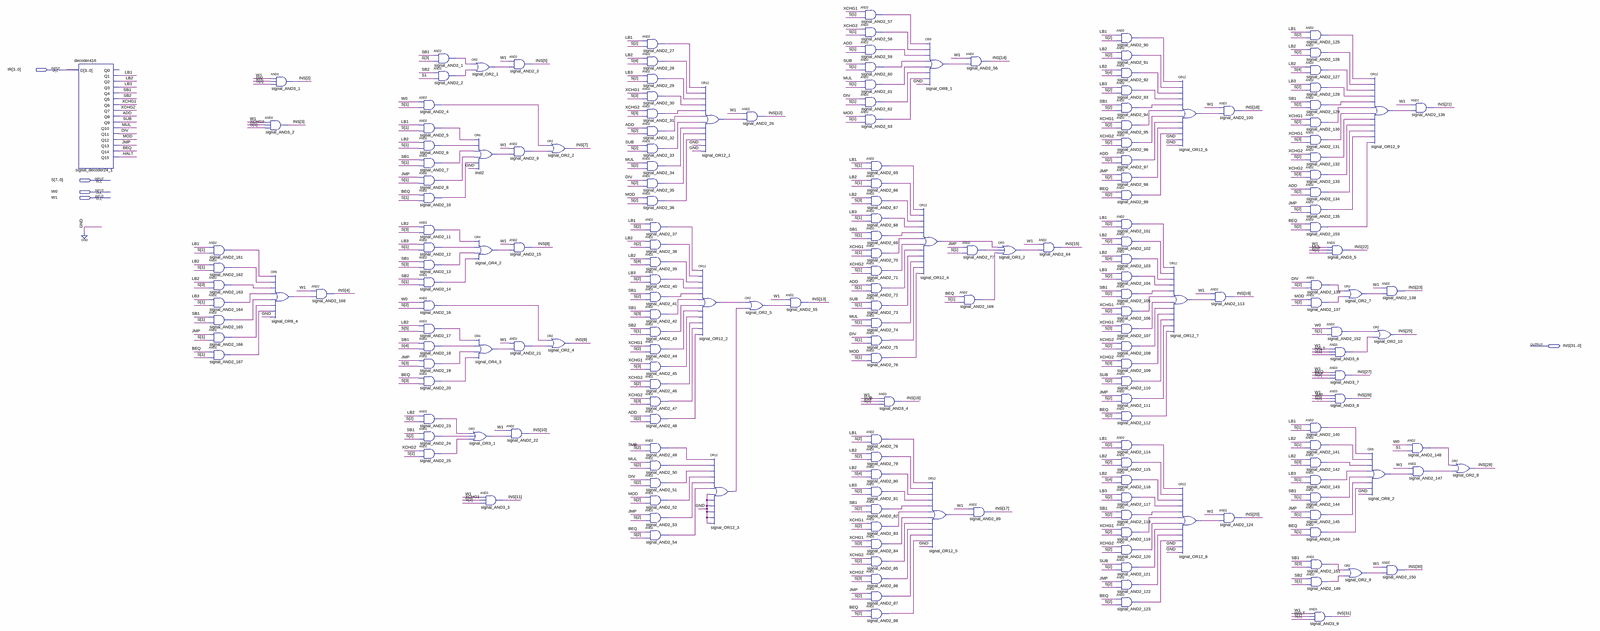
[diagram p0: schematic sheet, whole]
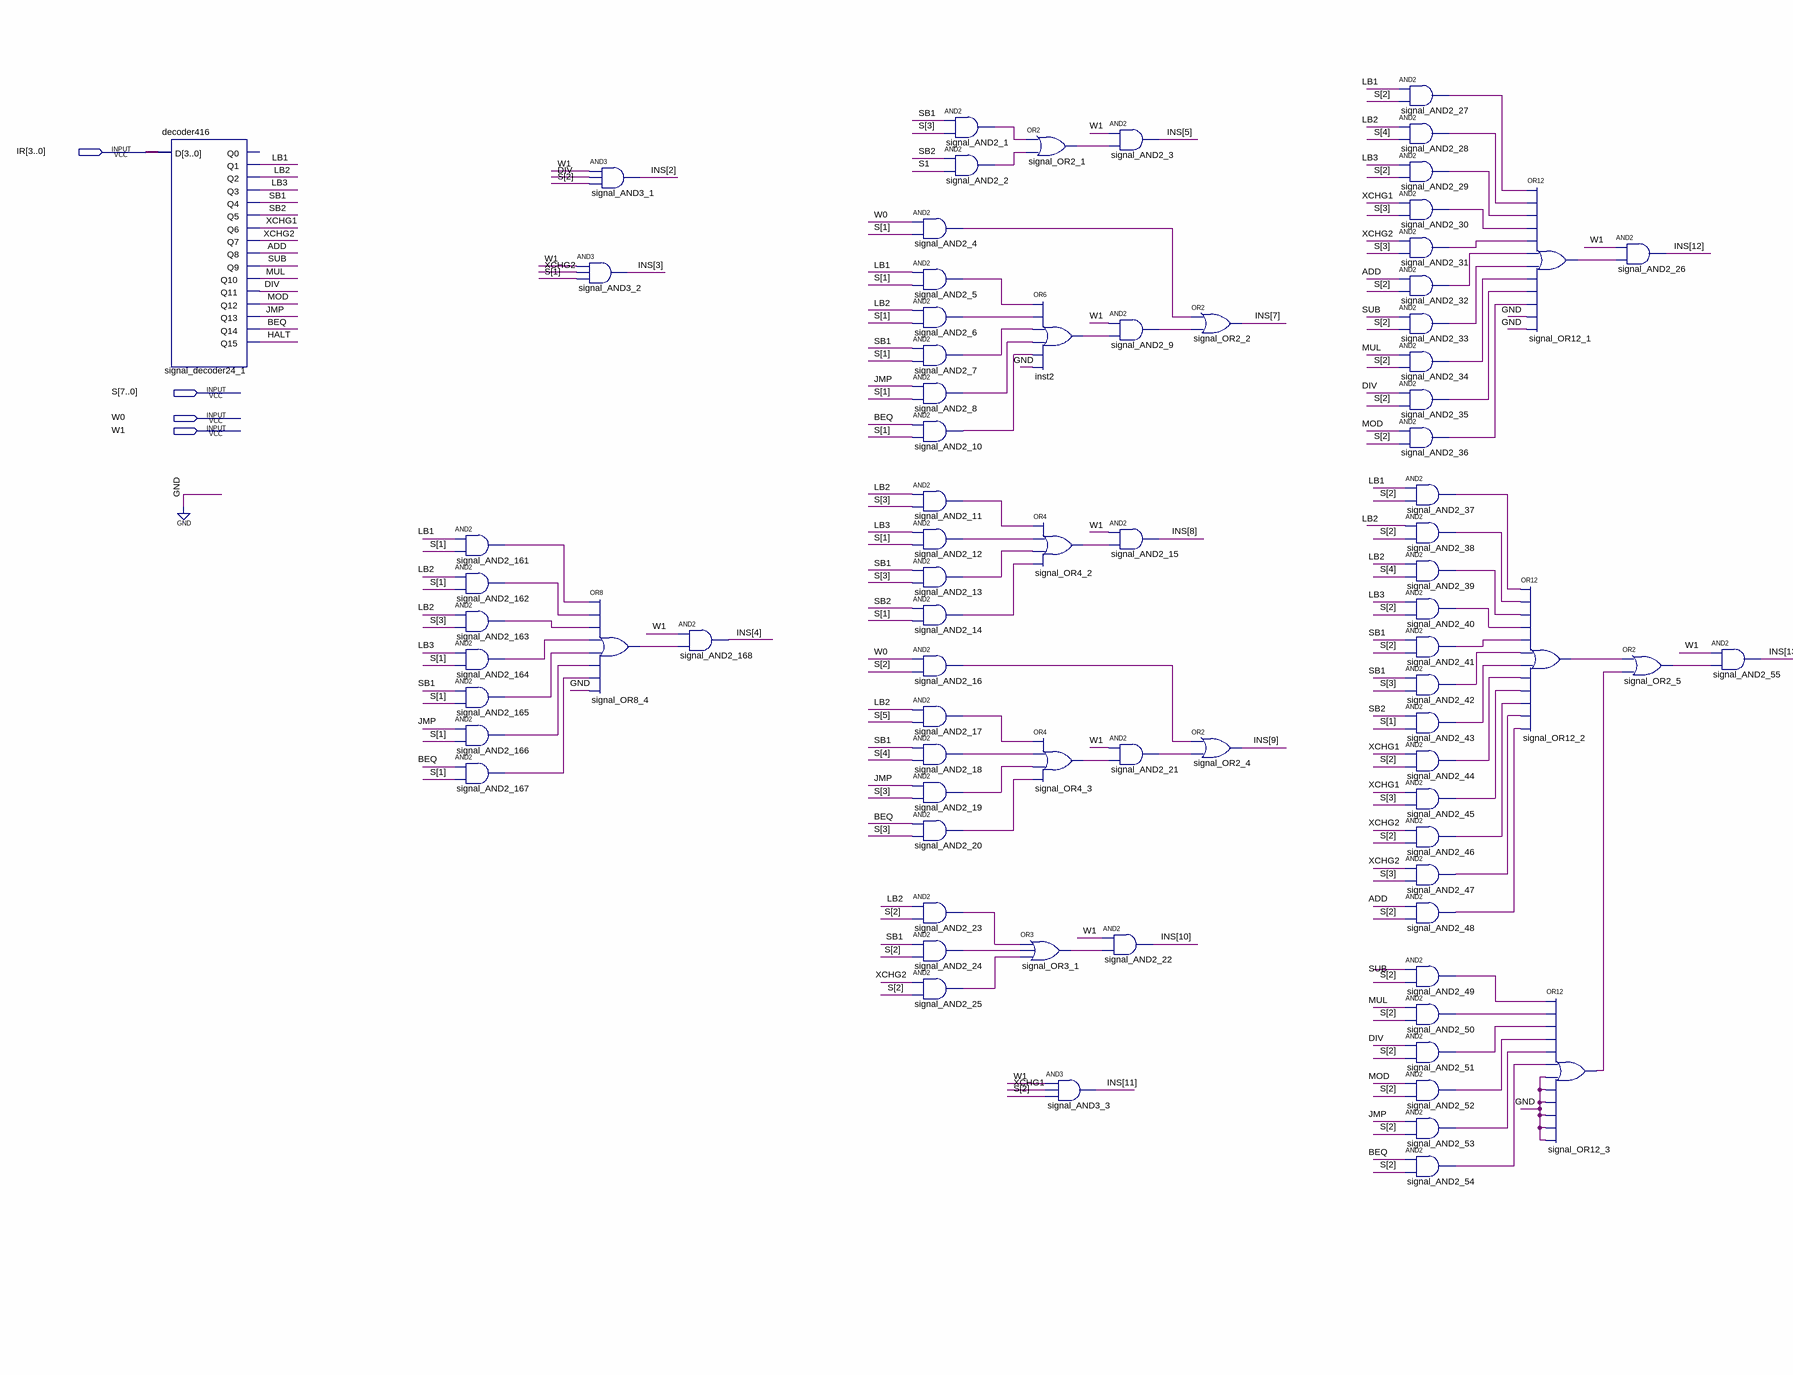
[diagram p1: schematic sheet, left part]
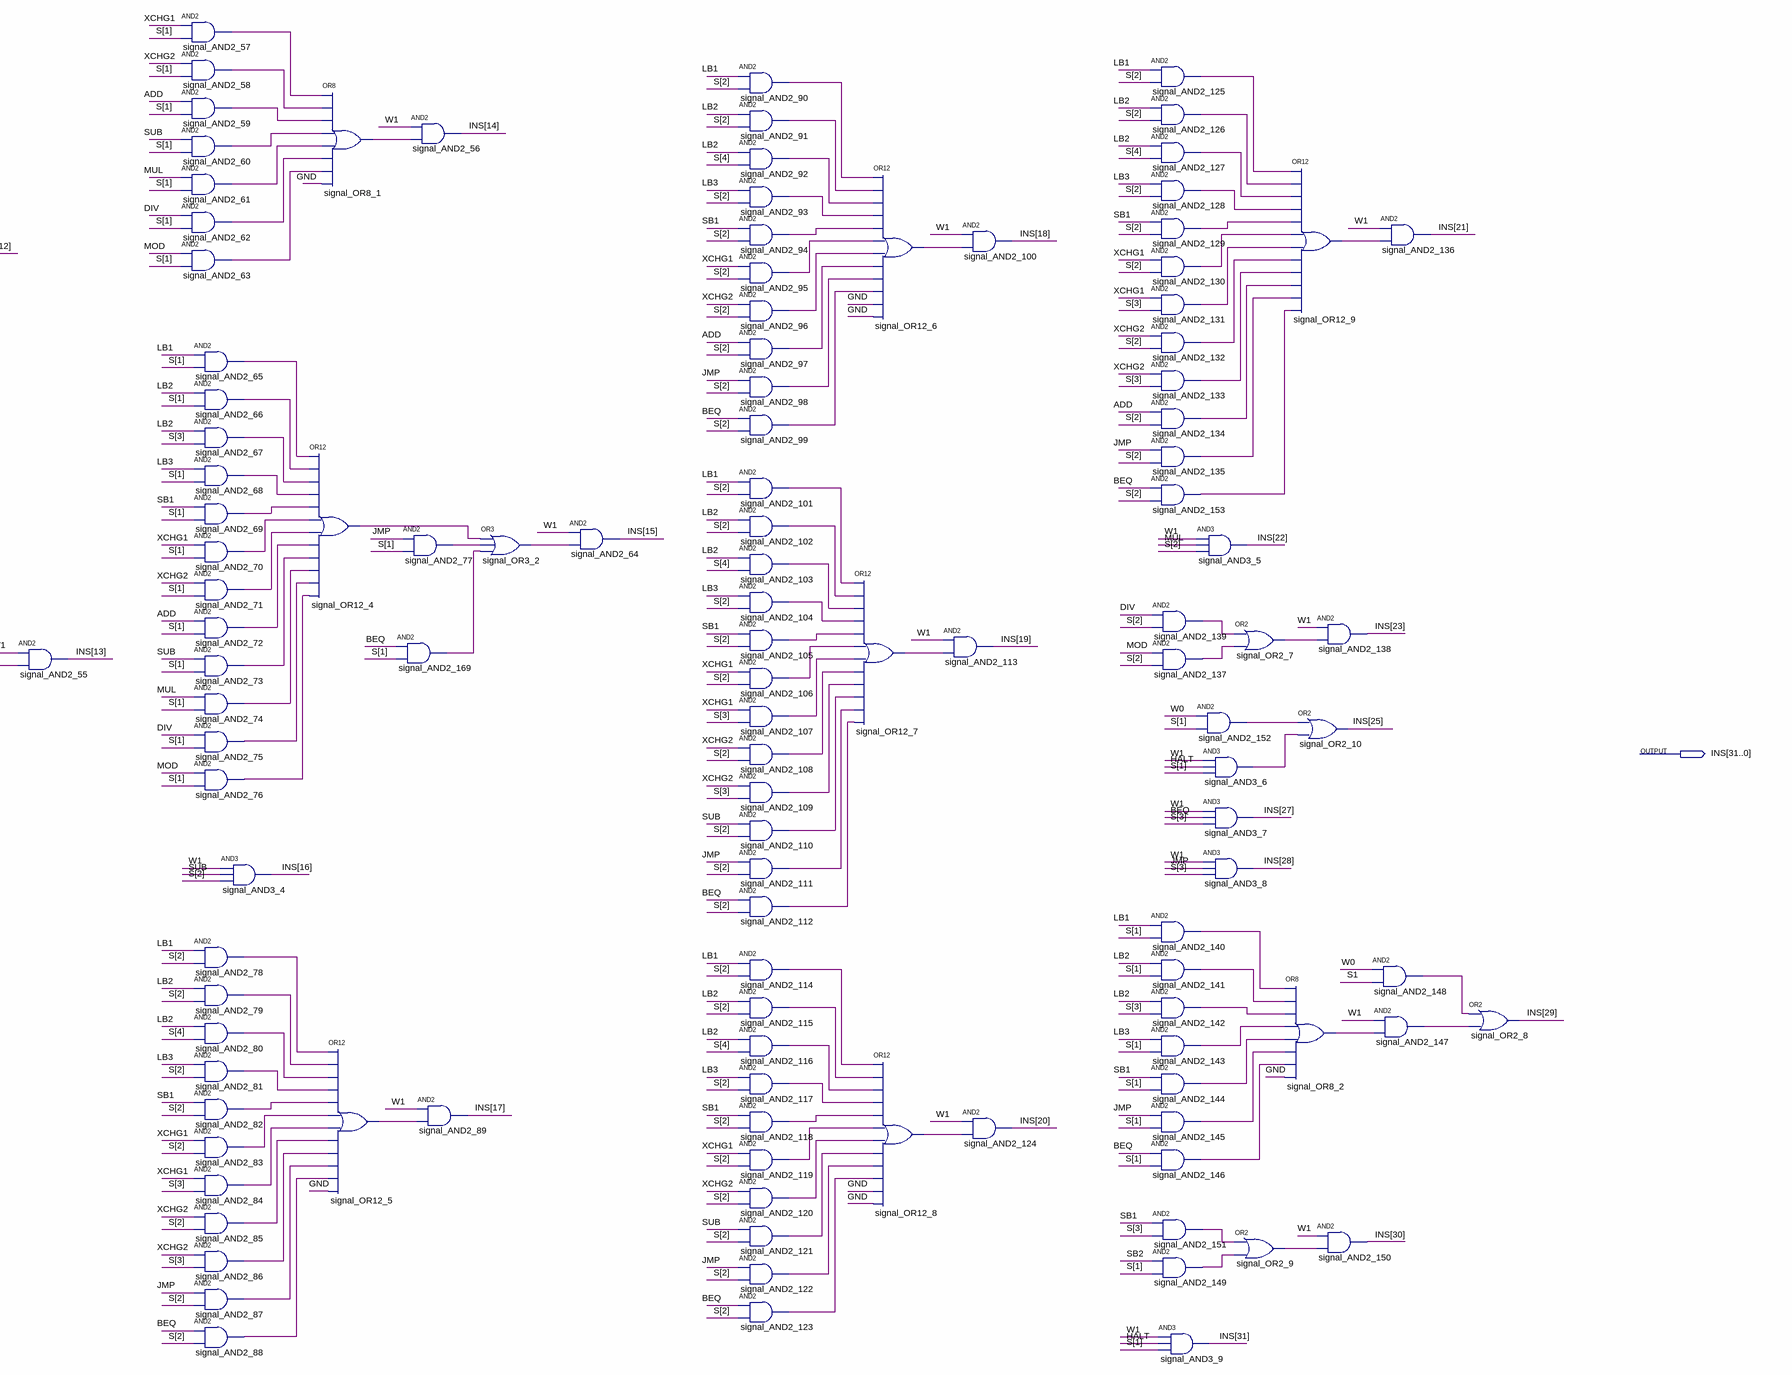
[diagram p2: schematic sheet, right part]
// Quartus schematic signal.bdf as structural Verilog: 197 symbols, 5 pins
module signal (
  input  [3:0] IR,
  input  [7:0] S,
  input  W0,
  input  W1,
  output [31:0] INS
);

  wire ADD, BEQ, DIV, HALT, inst2_out, JMP, LB1, LB2, LB3, MOD, MUL, SB1, SB2, signal_AND2_1_out,
       signal_AND2_2_out, signal_AND2_4_out, signal_AND2_5_out, signal_AND2_6_out, signal_AND2_7_out,
       signal_AND2_8_out, signal_AND2_9_out, signal_AND2_10_out, signal_AND2_11_out, signal_AND2_12_out,
       signal_AND2_13_out, signal_AND2_14_out, signal_AND2_16_out, signal_AND2_17_out, signal_AND2_18_out,
       signal_AND2_19_out, signal_AND2_20_out, signal_AND2_21_out, signal_AND2_23_out, signal_AND2_24_out,
       signal_AND2_25_out, signal_AND2_27_out, signal_AND2_28_out, signal_AND2_29_out, signal_AND2_30_out,
       signal_AND2_31_out, signal_AND2_32_out, signal_AND2_33_out, signal_AND2_34_out, signal_AND2_35_out,
       signal_AND2_36_out, signal_AND2_37_out, signal_AND2_38_out, signal_AND2_39_out, signal_AND2_40_out,
       signal_AND2_41_out, signal_AND2_42_out, signal_AND2_43_out, signal_AND2_44_out, signal_AND2_45_out,
       signal_AND2_46_out, signal_AND2_47_out, signal_AND2_48_out, signal_AND2_49_out, signal_AND2_50_out,
       signal_AND2_51_out, signal_AND2_52_out, signal_AND2_53_out, signal_AND2_54_out, signal_AND2_57_out,
       signal_AND2_58_out, signal_AND2_59_out, signal_AND2_60_out, signal_AND2_61_out, signal_AND2_62_out,
       signal_AND2_63_out, signal_AND2_65_out, signal_AND2_66_out, signal_AND2_67_out, signal_AND2_68_out,
       signal_AND2_69_out, signal_AND2_70_out, signal_AND2_71_out, signal_AND2_72_out, signal_AND2_73_out,
       signal_AND2_74_out, signal_AND2_75_out, signal_AND2_76_out, signal_AND2_77_out, signal_AND2_78_out,
       signal_AND2_79_out, signal_AND2_80_out, signal_AND2_81_out, signal_AND2_82_out, signal_AND2_83_out,
       signal_AND2_84_out, signal_AND2_85_out, signal_AND2_86_out, signal_AND2_87_out, signal_AND2_88_out,
       signal_AND2_90_out, signal_AND2_91_out, signal_AND2_92_out, signal_AND2_93_out, signal_AND2_94_out,
       signal_AND2_95_out, signal_AND2_96_out, signal_AND2_97_out, signal_AND2_98_out, signal_AND2_99_out,
       signal_AND2_101_out, signal_AND2_102_out, signal_AND2_103_out, signal_AND2_104_out,
       signal_AND2_105_out, signal_AND2_106_out, signal_AND2_107_out, signal_AND2_108_out,
       signal_AND2_109_out, signal_AND2_110_out, signal_AND2_111_out, signal_AND2_112_out,
       signal_AND2_114_out, signal_AND2_115_out, signal_AND2_116_out, signal_AND2_117_out,
       signal_AND2_118_out, signal_AND2_119_out, signal_AND2_120_out, signal_AND2_121_out,
       signal_AND2_122_out, signal_AND2_123_out, signal_AND2_125_out, signal_AND2_126_out,
       signal_AND2_127_out, signal_AND2_128_out, signal_AND2_129_out, signal_AND2_130_out,
       signal_AND2_131_out, signal_AND2_132_out, signal_AND2_133_out, signal_AND2_134_out,
       signal_AND2_135_out, signal_AND2_137_out, signal_AND2_139_out, signal_AND2_140_out,
       signal_AND2_141_out, signal_AND2_142_out, signal_AND2_143_out, signal_AND2_144_out,
       signal_AND2_145_out, signal_AND2_146_out, signal_AND2_147_out, signal_AND2_148_out,
       signal_AND2_149_out, signal_AND2_151_out, signal_AND2_152_out, signal_AND2_153_out,
       signal_AND2_161_out, signal_AND2_162_out, signal_AND2_163_out, signal_AND2_164_out,
       signal_AND2_165_out, signal_AND2_166_out, signal_AND2_167_out, signal_AND2_169_out, signal_AND3_6_out,
       signal_OR2_1_out, signal_OR2_5_out, signal_OR2_7_out, signal_OR2_9_out, signal_OR3_1_out,
       signal_OR3_2_out, signal_OR4_2_out, signal_OR4_3_out, signal_OR8_1_out, signal_OR8_2_out,
       signal_OR8_4_out, signal_OR12_1_out, signal_OR12_2_out, signal_OR12_3_out, signal_OR12_4_out,
       signal_OR12_5_out, signal_OR12_6_out, signal_OR12_7_out, signal_OR12_8_out, signal_OR12_9_out, SUB,
       XCHG1, XCHG2;

  decoder416 signal_decoder24_1 (
    .D(IR), .Q1(LB1), .Q2(LB2), .Q3(LB3), .Q4(SB1), .Q5(SB2), .Q6(XCHG1), .Q7(XCHG2), .Q8(ADD), .Q9(SUB),
    .Q10(MUL), .Q11(DIV), .Q12(MOD), .Q13(JMP), .Q14(BEQ), .Q15(HALT));  // open: Q0
  and signal_AND2_161 (signal_AND2_161_out, LB1, S[1]);
  and signal_AND2_162 (signal_AND2_162_out, LB2, S[1]);
  and signal_AND2_163 (signal_AND2_163_out, LB2, S[3]);
  and signal_AND2_164 (signal_AND2_164_out, LB3, S[1]);
  and signal_AND2_165 (signal_AND2_165_out, SB1, S[1]);
  and signal_AND2_166 (signal_AND2_166_out, JMP, S[1]);
  and signal_AND2_167 (signal_AND2_167_out, BEQ, S[1]);
  and signal_AND3_1 (INS[2], W1, DIV, S[2]);
  and signal_AND3_2 (INS[3], W1, XCHG2, S[1]);
  or signal_OR8_4 (signal_OR8_4_out, signal_AND2_161_out, signal_AND2_162_out, signal_AND2_163_out, signal_AND2_164_out, signal_AND2_165_out, signal_AND2_166_out, signal_AND2_167_out, 1'b0);
  and signal_AND2_168 (INS[4], W1, signal_OR8_4_out);
  and signal_AND2_1 (signal_AND2_1_out, SB1, S[3]);
  and signal_AND2_2 (signal_AND2_2_out, SB2, S[1]);
  and signal_AND2_4 (signal_AND2_4_out, W0, S[1]);
  and signal_AND2_5 (signal_AND2_5_out, LB1, S[1]);
  and signal_AND2_6 (signal_AND2_6_out, LB2, S[1]);
  and signal_AND2_7 (signal_AND2_7_out, SB1, S[1]);
  and signal_AND2_8 (signal_AND2_8_out, JMP, S[1]);
  and signal_AND2_10 (signal_AND2_10_out, BEQ, S[1]);
  and signal_AND2_11 (signal_AND2_11_out, LB2, S[3]);
  and signal_AND2_12 (signal_AND2_12_out, LB3, S[1]);
  and signal_AND2_13 (signal_AND2_13_out, SB1, S[3]);
  and signal_AND2_14 (signal_AND2_14_out, SB2, S[1]);
  and signal_AND2_16 (signal_AND2_16_out, W0, S[2]);
  and signal_AND2_17 (signal_AND2_17_out, LB2, S[5]);
  and signal_AND2_18 (signal_AND2_18_out, SB1, S[4]);
  and signal_AND2_19 (signal_AND2_19_out, JMP, S[3]);
  and signal_AND2_20 (signal_AND2_20_out, BEQ, S[3]);
  and signal_AND2_23 (signal_AND2_23_out, LB2, S[2]);
  and signal_AND2_24 (signal_AND2_24_out, SB1, S[2]);
  and signal_AND2_25 (signal_AND2_25_out, XCHG2, S[2]);
  or signal_OR2_1 (signal_OR2_1_out, signal_AND2_1_out, signal_AND2_2_out);
  or inst2 (inst2_out, signal_AND2_5_out, signal_AND2_6_out, signal_AND2_7_out, signal_AND2_8_out, signal_AND2_10_out, 1'b0);
  or signal_OR4_2 (signal_OR4_2_out, signal_AND2_11_out, signal_AND2_12_out, signal_AND2_13_out, signal_AND2_14_out);
  or signal_OR4_3 (signal_OR4_3_out, signal_AND2_17_out, signal_AND2_18_out, signal_AND2_19_out, signal_AND2_20_out);
  or signal_OR3_1 (signal_OR3_1_out, signal_AND2_23_out, signal_AND2_24_out, signal_AND2_25_out);
  and signal_AND3_3 (INS[11], W1, XCHG1, S[2]);
  and signal_AND2_3 (INS[5], W1, signal_OR2_1_out);
  and signal_AND2_9 (signal_AND2_9_out, W1, inst2_out);
  and signal_AND2_15 (INS[8], W1, signal_OR4_2_out);
  and signal_AND2_21 (signal_AND2_21_out, W1, signal_OR4_3_out);
  and signal_AND2_22 (INS[10], W1, signal_OR3_1_out);
  or signal_OR2_2 (INS[7], signal_AND2_4_out, signal_AND2_9_out);
  or signal_OR2_4 (INS[9], signal_AND2_16_out, signal_AND2_21_out);
  and signal_AND2_27 (signal_AND2_27_out, LB1, S[2]);
  and signal_AND2_28 (signal_AND2_28_out, LB2, S[4]);
  and signal_AND2_29 (signal_AND2_29_out, LB3, S[2]);
  and signal_AND2_30 (signal_AND2_30_out, XCHG1, S[3]);
  and signal_AND2_31 (signal_AND2_31_out, XCHG2, S[3]);
  and signal_AND2_32 (signal_AND2_32_out, ADD, S[2]);
  and signal_AND2_33 (signal_AND2_33_out, SUB, S[2]);
  and signal_AND2_34 (signal_AND2_34_out, MUL, S[2]);
  and signal_AND2_35 (signal_AND2_35_out, DIV, S[2]);
  and signal_AND2_36 (signal_AND2_36_out, MOD, S[2]);
  and signal_AND2_37 (signal_AND2_37_out, LB1, S[2]);
  and signal_AND2_38 (signal_AND2_38_out, LB2, S[2]);
  and signal_AND2_39 (signal_AND2_39_out, LB2, S[4]);
  and signal_AND2_40 (signal_AND2_40_out, LB3, S[2]);
  and signal_AND2_41 (signal_AND2_41_out, SB1, S[2]);
  and signal_AND2_42 (signal_AND2_42_out, SB1, S[3]);
  and signal_AND2_43 (signal_AND2_43_out, SB2, S[1]);
  and signal_AND2_44 (signal_AND2_44_out, XCHG1, S[2]);
  and signal_AND2_45 (signal_AND2_45_out, XCHG1, S[3]);
  and signal_AND2_46 (signal_AND2_46_out, XCHG2, S[2]);
  and signal_AND2_47 (signal_AND2_47_out, XCHG2, S[3]);
  and signal_AND2_48 (signal_AND2_48_out, ADD, S[2]);
  and signal_AND2_49 (signal_AND2_49_out, SUB, S[2]);
  and signal_AND2_50 (signal_AND2_50_out, MUL, S[2]);
  and signal_AND2_51 (signal_AND2_51_out, DIV, S[2]);
  and signal_AND2_52 (signal_AND2_52_out, MOD, S[2]);
  and signal_AND2_53 (signal_AND2_53_out, JMP, S[2]);
  and signal_AND2_54 (signal_AND2_54_out, BEQ, S[2]);
  or signal_OR12_1 (signal_OR12_1_out, signal_AND2_27_out, signal_AND2_28_out, signal_AND2_29_out, signal_AND2_30_out, signal_AND2_31_out, signal_AND2_32_out, signal_AND2_33_out, signal_AND2_34_out, signal_AND2_35_out, signal_AND2_36_out, 1'b0, 1'b0);
  or signal_OR12_2 (signal_OR12_2_out, signal_AND2_37_out, signal_AND2_38_out, signal_AND2_39_out, signal_AND2_40_out, signal_AND2_41_out, signal_AND2_42_out, signal_AND2_43_out, signal_AND2_44_out, signal_AND2_45_out, signal_AND2_46_out, signal_AND2_47_out, signal_AND2_48_out);
  or signal_OR12_3 (signal_OR12_3_out, signal_AND2_49_out, signal_AND2_50_out, signal_AND2_51_out, signal_AND2_52_out, signal_AND2_53_out, signal_AND2_54_out, 1'b0, 1'b0, 1'b0, 1'b0, 1'b0, 1'b0);
  and signal_AND2_26 (INS[12], W1, signal_OR12_1_out);
  or signal_OR2_5 (signal_OR2_5_out, signal_OR12_2_out, signal_OR12_3_out);
  and signal_AND2_55 (INS[13], W1, signal_OR2_5_out);
  and signal_AND2_57 (signal_AND2_57_out, XCHG1, S[1]);
  and signal_AND2_58 (signal_AND2_58_out, XCHG2, S[1]);
  and signal_AND2_59 (signal_AND2_59_out, ADD, S[1]);
  and signal_AND2_60 (signal_AND2_60_out, SUB, S[1]);
  and signal_AND2_61 (signal_AND2_61_out, MUL, S[1]);
  and signal_AND2_62 (signal_AND2_62_out, DIV, S[1]);
  and signal_AND2_63 (signal_AND2_63_out, MOD, S[1]);
  and signal_AND2_65 (signal_AND2_65_out, LB1, S[1]);
  and signal_AND2_66 (signal_AND2_66_out, LB2, S[1]);
  and signal_AND2_67 (signal_AND2_67_out, LB2, S[3]);
  and signal_AND2_68 (signal_AND2_68_out, LB3, S[1]);
  and signal_AND2_69 (signal_AND2_69_out, SB1, S[1]);
  and signal_AND2_70 (signal_AND2_70_out, XCHG1, S[1]);
  and signal_AND2_71 (signal_AND2_71_out, XCHG2, S[1]);
  and signal_AND2_72 (signal_AND2_72_out, ADD, S[1]);
  and signal_AND2_73 (signal_AND2_73_out, SUB, S[1]);
  and signal_AND2_74 (signal_AND2_74_out, MUL, S[1]);
  and signal_AND2_75 (signal_AND2_75_out, DIV, S[1]);
  and signal_AND2_76 (signal_AND2_76_out, MOD, S[1]);
  and signal_AND3_4 (INS[16], W1, SUB, S[2]);
  and signal_AND2_78 (signal_AND2_78_out, LB1, S[2]);
  and signal_AND2_79 (signal_AND2_79_out, LB2, S[2]);
  and signal_AND2_80 (signal_AND2_80_out, LB2, S[4]);
  and signal_AND2_81 (signal_AND2_81_out, LB3, S[2]);
  and signal_AND2_82 (signal_AND2_82_out, SB1, S[2]);
  and signal_AND2_83 (signal_AND2_83_out, XCHG1, S[2]);
  and signal_AND2_84 (signal_AND2_84_out, XCHG1, S[3]);
  and signal_AND2_85 (signal_AND2_85_out, XCHG2, S[2]);
  and signal_AND2_86 (signal_AND2_86_out, XCHG2, S[3]);
  and signal_AND2_87 (signal_AND2_87_out, JMP, S[2]);
  and signal_AND2_88 (signal_AND2_88_out, BEQ, S[2]);
  or signal_OR8_1 (signal_OR8_1_out, signal_AND2_57_out, signal_AND2_58_out, signal_AND2_59_out, signal_AND2_60_out, signal_AND2_61_out, signal_AND2_62_out, signal_AND2_63_out, 1'b0);
  or signal_OR12_4 (signal_OR12_4_out, signal_AND2_65_out, signal_AND2_66_out, signal_AND2_67_out, signal_AND2_68_out, signal_AND2_69_out, signal_AND2_70_out, signal_AND2_71_out, signal_AND2_72_out, signal_AND2_73_out, signal_AND2_74_out, signal_AND2_75_out, signal_AND2_76_out);
  or signal_OR12_5 (signal_OR12_5_out, signal_AND2_78_out, signal_AND2_79_out, signal_AND2_80_out, signal_AND2_81_out, signal_AND2_82_out, signal_AND2_83_out, signal_AND2_84_out, signal_AND2_85_out, signal_AND2_86_out, signal_AND2_87_out, signal_AND2_88_out, 1'b0);
  and signal_AND2_56 (INS[14], W1, signal_OR8_1_out);
  and signal_AND2_77 (signal_AND2_77_out, JMP, S[1]);
  and signal_AND2_169 (signal_AND2_169_out, BEQ, S[1]);
  and signal_AND2_89 (INS[17], W1, signal_OR12_5_out);
  or signal_OR3_2 (signal_OR3_2_out, signal_OR12_4_out, signal_AND2_77_out, signal_AND2_169_out);
  and signal_AND2_64 (INS[15], W1, signal_OR3_2_out);
  and signal_AND2_90 (signal_AND2_90_out, LB1, S[2]);
  and signal_AND2_91 (signal_AND2_91_out, LB2, S[2]);
  and signal_AND2_92 (signal_AND2_92_out, LB2, S[4]);
  and signal_AND2_93 (signal_AND2_93_out, LB3, S[2]);
  and signal_AND2_94 (signal_AND2_94_out, SB1, S[2]);
  and signal_AND2_95 (signal_AND2_95_out, XCHG1, S[2]);
  and signal_AND2_96 (signal_AND2_96_out, XCHG2, S[2]);
  and signal_AND2_97 (signal_AND2_97_out, ADD, S[2]);
  and signal_AND2_98 (signal_AND2_98_out, JMP, S[2]);
  and signal_AND2_99 (signal_AND2_99_out, BEQ, S[2]);
  and signal_AND2_101 (signal_AND2_101_out, LB1, S[2]);
  and signal_AND2_102 (signal_AND2_102_out, LB2, S[2]);
  and signal_AND2_103 (signal_AND2_103_out, LB2, S[4]);
  and signal_AND2_104 (signal_AND2_104_out, LB3, S[2]);
  and signal_AND2_105 (signal_AND2_105_out, SB1, S[2]);
  and signal_AND2_106 (signal_AND2_106_out, XCHG1, S[2]);
  and signal_AND2_107 (signal_AND2_107_out, XCHG1, S[3]);
  and signal_AND2_108 (signal_AND2_108_out, XCHG2, S[2]);
  and signal_AND2_109 (signal_AND2_109_out, XCHG2, S[3]);
  and signal_AND2_110 (signal_AND2_110_out, SUB, S[2]);
  and signal_AND2_111 (signal_AND2_111_out, JMP, S[2]);
  and signal_AND2_112 (signal_AND2_112_out, BEQ, S[2]);
  and signal_AND2_114 (signal_AND2_114_out, LB1, S[2]);
  and signal_AND2_115 (signal_AND2_115_out, LB2, S[2]);
  and signal_AND2_116 (signal_AND2_116_out, LB2, S[4]);
  and signal_AND2_117 (signal_AND2_117_out, LB3, S[2]);
  and signal_AND2_118 (signal_AND2_118_out, SB1, S[2]);
  and signal_AND2_119 (signal_AND2_119_out, XCHG1, S[2]);
  and signal_AND2_120 (signal_AND2_120_out, XCHG2, S[2]);
  and signal_AND2_121 (signal_AND2_121_out, SUB, S[2]);
  and signal_AND2_122 (signal_AND2_122_out, JMP, S[2]);
  and signal_AND2_123 (signal_AND2_123_out, BEQ, S[2]);
  or signal_OR12_6 (signal_OR12_6_out, signal_AND2_90_out, signal_AND2_91_out, signal_AND2_92_out, signal_AND2_93_out, signal_AND2_94_out, signal_AND2_95_out, signal_AND2_96_out, signal_AND2_97_out, signal_AND2_98_out, signal_AND2_99_out, 1'b0, 1'b0);
  or signal_OR12_7 (signal_OR12_7_out, signal_AND2_101_out, signal_AND2_102_out, signal_AND2_103_out, signal_AND2_104_out, signal_AND2_105_out, signal_AND2_106_out, signal_AND2_107_out, signal_AND2_108_out, signal_AND2_109_out, signal_AND2_110_out, signal_AND2_111_out, signal_AND2_112_out);
  or signal_OR12_8 (signal_OR12_8_out, signal_AND2_114_out, signal_AND2_115_out, signal_AND2_116_out, signal_AND2_117_out, signal_AND2_118_out, signal_AND2_119_out, signal_AND2_120_out, signal_AND2_121_out, signal_AND2_122_out, signal_AND2_123_out, 1'b0, 1'b0);
  and signal_AND2_100 (INS[18], W1, signal_OR12_6_out);
  and signal_AND2_113 (INS[19], W1, signal_OR12_7_out);
  and signal_AND2_124 (INS[20], W1, signal_OR12_8_out);
  and signal_AND2_125 (signal_AND2_125_out, LB1, S[2]);
  and signal_AND2_126 (signal_AND2_126_out, LB2, S[2]);
  and signal_AND2_127 (signal_AND2_127_out, LB2, S[4]);
  and signal_AND2_128 (signal_AND2_128_out, LB3, S[2]);
  and signal_AND2_129 (signal_AND2_129_out, SB1, S[2]);
  and signal_AND2_130 (signal_AND2_130_out, XCHG1, S[2]);
  and signal_AND2_131 (signal_AND2_131_out, XCHG1, S[3]);
  and signal_AND2_132 (signal_AND2_132_out, XCHG2, S[2]);
  and signal_AND2_133 (signal_AND2_133_out, XCHG2, S[3]);
  and signal_AND2_134 (signal_AND2_134_out, ADD, S[2]);
  and signal_AND2_135 (signal_AND2_135_out, JMP, S[2]);
  and signal_AND2_153 (signal_AND2_153_out, BEQ, S[2]);
  and signal_AND2_139 (signal_AND2_139_out, DIV, S[2]);
  and signal_AND2_137 (signal_AND2_137_out, MOD, S[2]);
  and signal_AND2_140 (signal_AND2_140_out, LB1, S[1]);
  and signal_AND2_141 (signal_AND2_141_out, LB2, S[1]);
  and signal_AND2_142 (signal_AND2_142_out, LB2, S[3]);
  and signal_AND2_143 (signal_AND2_143_out, LB3, S[1]);
  and signal_AND2_144 (signal_AND2_144_out, SB1, S[1]);
  and signal_AND2_145 (signal_AND2_145_out, JMP, S[1]);
  and signal_AND2_146 (signal_AND2_146_out, BEQ, S[1]);
  and signal_AND2_151 (signal_AND2_151_out, SB1, S[3]);
  and signal_AND2_149 (signal_AND2_149_out, SB2, S[1]);
  and signal_AND3_9 (INS[31], W1, HALT, S[1]);
  and signal_AND3_5 (INS[22], W1, MUL, S[2]);
  or signal_OR2_7 (signal_OR2_7_out, signal_AND2_139_out, signal_AND2_137_out);
  and signal_AND2_152 (signal_AND2_152_out, W0, S[1]);
  and signal_AND3_6 (signal_AND3_6_out, W1, HALT, S[1]);
  and signal_AND3_7 (INS[27], W1, BEQ, S[3]);
  and signal_AND3_8 (INS[28], W1, JMP, S[3]);
  or signal_OR2_9 (signal_OR2_9_out, signal_AND2_151_out, signal_AND2_149_out);
  or signal_OR12_9 (signal_OR12_9_out, signal_AND2_125_out, signal_AND2_126_out, signal_AND2_127_out, signal_AND2_128_out, signal_AND2_129_out, signal_AND2_130_out, signal_AND2_131_out, signal_AND2_132_out, signal_AND2_133_out, signal_AND2_134_out, signal_AND2_135_out, signal_AND2_153_out);
  or signal_OR8_2 (signal_OR8_2_out, signal_AND2_140_out, signal_AND2_141_out, signal_AND2_142_out, signal_AND2_143_out, signal_AND2_144_out, signal_AND2_145_out, signal_AND2_146_out, 1'b0);
  and signal_AND2_138 (INS[23], W1, signal_OR2_7_out);
  or signal_OR2_10 (INS[25], signal_AND2_152_out, signal_AND3_6_out);
  and signal_AND2_150 (INS[30], W1, signal_OR2_9_out);
  and signal_AND2_136 (INS[21], W1, signal_OR12_9_out);
  and signal_AND2_148 (signal_AND2_148_out, W0, S[1]);
  and signal_AND2_147 (signal_AND2_147_out, W1, signal_OR8_2_out);
  or signal_OR2_8 (INS[29], signal_AND2_148_out, signal_AND2_147_out);
endmodule
